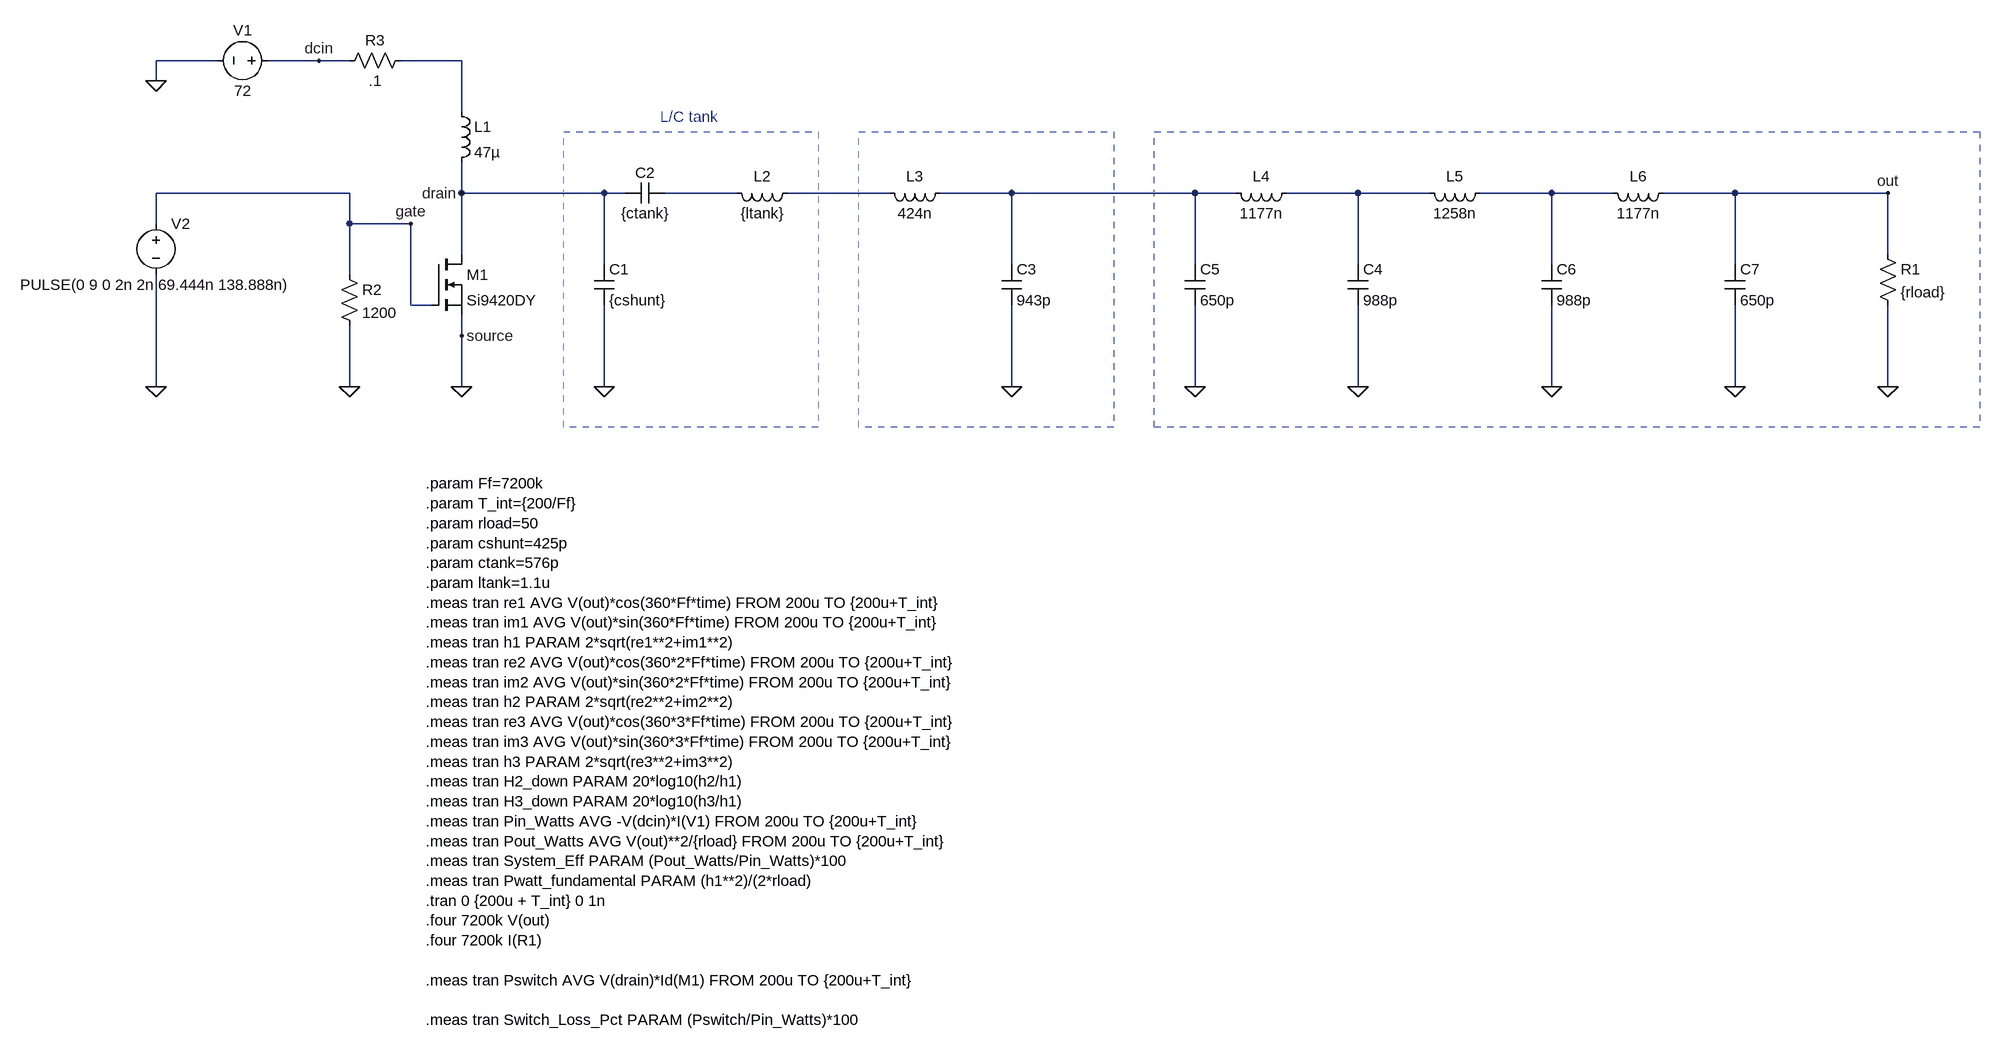
[diagram p0: schematic 7200KHZ_e.asc]
7200KHZ_e.asc, the LTspice schematic file:
Version 4.1
SHEET 1 2816 1392
WIRE -192 -272 -288 -272
WIRE -32 -272 -112 -272
WIRE 16 -272 -32 -272
WIRE 192 -272 96 -272
WIRE -288 -240 -288 -272
WIRE 192 -192 192 -272
WIRE 16 -64 -288 -64
WIRE 192 -64 192 -112
WIRE 416 -64 192 -64
WIRE 448 -64 416 -64
WIRE 624 -64 512 -64
WIRE 864 -64 704 -64
WIRE 1056 -64 944 -64
WIRE 1344 -64 1056 -64
WIRE 1408 -64 1344 -64
WIRE 1600 -64 1488 -64
WIRE 1712 -64 1600 -64
WIRE 1904 -64 1792 -64
WIRE 2000 -64 1904 -64
WIRE 2192 -64 2080 -64
WIRE 2432 -64 2192 -64
WIRE -288 -16 -288 -64
WIRE 16 -16 16 -64
WIRE 112 -16 16 -16
WIRE 192 32 192 -64
WIRE 2432 32 2432 -64
WIRE 416 48 416 -64
WIRE 1056 48 1056 -64
WIRE 1344 48 1344 -64
WIRE 1600 48 1600 -64
WIRE 1904 48 1904 -64
WIRE 2192 48 2192 -64
WIRE 16 64 16 -16
WIRE 112 112 112 -16
WIRE 144 112 112 112
WIRE 192 160 192 128
WIRE -288 240 -288 64
WIRE 16 240 16 144
WIRE 192 240 192 160
WIRE 416 240 416 112
WIRE 1056 240 1056 112
WIRE 1344 240 1344 112
WIRE 1600 240 1600 112
WIRE 1904 240 1904 112
WIRE 2192 240 2192 112
WIRE 2432 240 2432 112
FLAG 192 240 0
FLAG -288 -240 0
FLAG -288 240 0
FLAG 416 240 0
FLAG -32 -272 dcin
FLAG 16 240 0
FLAG 112 -16 gate
FLAG 192 -64 drain
FLAG 192 160 source
FLAG 1056 240 0
FLAG 1600 240 0
FLAG 1344 240 0
FLAG 1904 240 0
FLAG 2192 240 0
FLAG 2432 -64 out
FLAG 2432 240 0
SYMBOL nmos 144 32 R0
SYMATTR InstName M1
SYMATTR Value Si9420DY
SYMBOL ind 176 -208 R0
SYMATTR InstName L1
SYMATTR Value 47µ
SYMBOL cap 512 -80 R90
WINDOW 0 0 32 VBottom 2
WINDOW 3 32 32 VTop 2
SYMATTR InstName C2
SYMATTR Value {ctank}
SYMATTR SpiceLine Rser=0.1
SYMBOL ind 720 -80 R90
WINDOW 0 5 56 VBottom 2
WINDOW 3 32 56 VTop 2
SYMATTR InstName L2
SYMATTR Value {ltank}
SYMBOL voltage -288 -32 R0
WINDOW 123 0 0 Left 0
WINDOW 39 0 0 Left 0
WINDOW 3 -213 112 Left 2
SYMATTR Value PULSE(0 9 0 2n 2n 69.444n 138.888n)
SYMATTR InstName V2
SYMBOL res 0 48 R0
SYMATTR InstName R2
SYMATTR Value 1200
SYMBOL cap 400 48 R0
SYMATTR InstName C1
SYMATTR Value {cshunt}
SYMATTR SpiceLine Rser=0.1
SYMBOL res 112 -288 R90
WINDOW 0 0 56 VBottom 2
WINDOW 3 32 56 VTop 2
SYMATTR InstName R3
SYMATTR Value .1
SYMBOL voltage -96 -272 R90
WINDOW 0 -32 56 VBottom 2
WINDOW 3 32 56 VTop 2
WINDOW 123 0 0 Left 0
WINDOW 39 0 0 Left 0
SYMATTR InstName V1
SYMATTR Value 72
SYMBOL ind 960 -80 R90
WINDOW 0 5 56 VBottom 2
WINDOW 3 32 56 VTop 2
SYMATTR InstName L3
SYMATTR Value 424n
SYMBOL cap 1040 48 R0
SYMATTR InstName C3
SYMATTR Value 943p
SYMATTR SpiceLine Rser=0.1
SYMBOL ind 1504 -80 R90
WINDOW 0 5 56 VBottom 2
WINDOW 3 32 56 VTop 2
SYMATTR InstName L4
SYMATTR Value 1177n
SYMBOL cap 1584 48 R0
SYMATTR InstName C4
SYMATTR Value 988p
SYMATTR SpiceLine Rser=0.1
SYMBOL cap 1328 48 R0
SYMATTR InstName C5
SYMATTR Value 650p
SYMATTR SpiceLine Rser=0.1
SYMBOL ind 1808 -80 R90
WINDOW 0 5 56 VBottom 2
WINDOW 3 32 56 VTop 2
SYMATTR InstName L5
SYMATTR Value 1258n
SYMBOL cap 1888 48 R0
SYMATTR InstName C6
SYMATTR Value 988p
SYMATTR SpiceLine Rser=0.1
SYMBOL ind 2096 -80 R90
WINDOW 0 5 56 VBottom 2
WINDOW 3 32 56 VTop 2
SYMATTR InstName L6
SYMATTR Value 1177n
SYMBOL cap 2176 48 R0
SYMATTR InstName C7
SYMATTR Value 650p
SYMATTR SpiceLine Rser=0.1
SYMBOL res 2416 16 R0
SYMATTR InstName R1
SYMATTR Value {rload}
TEXT 136 392 Left 2 !.param Ff=7200k\n.param T_int={200/Ff}\n.param rload=50\n.param cshunt=425p\n.param ctank=576p\n.param ltank=1.1u\n.meas tran re1 AVG V(out)*cos(360*Ff*time) FROM 200u TO {200u+T_int}\n.meas tran im1 AVG V(out)*sin(360*Ff*time) FROM 200u TO {200u+T_int}\n.meas tran h1 PARAM 2*sqrt(re1**2+im1**2)\n.meas tran re2 AVG V(out)*cos(360*2*Ff*time) FROM 200u TO {200u+T_int}\n.meas tran im2 AVG V(out)*sin(360*2*Ff*time) FROM 200u TO {200u+T_int}\n.meas tran h2 PARAM 2*sqrt(re2**2+im2**2)\n.meas tran re3 AVG V(out)*cos(360*3*Ff*time) FROM 200u TO {200u+T_int}\n.meas tran im3 AVG V(out)*sin(360*3*Ff*time) FROM 200u TO {200u+T_int}\n.meas tran h3 PARAM 2*sqrt(re3**2+im3**2)\n.meas tran H2_down PARAM 20*log10(h2/h1)\n.meas tran H3_down PARAM 20*log10(h3/h1)\n.meas tran Pin_Watts AVG -V(dcin)*I(V1) FROM 200u TO {200u+T_int}\n.meas tran Pout_Watts AVG V(out)**2/{rload} FROM 200u TO {200u+T_int}\n.meas tran System_Eff PARAM (Pout_Watts/Pin_Watts)*100\n.meas tran Pwatt_fundamental PARAM (h1**2)/(2*rload)\n.tran 0 {200u + T_int} 0 1n\n.four 7200k V(out)\n.four 7200k I(R1)\n \n.meas tran Pswitch AVG V(drain)*Id(M1) FROM 200u TO {200u+T_int}\n \n.meas tran Switch_Loss_Pct PARAM (Pswitch/Pin_Watts)*100
TEXT 504 -184 Left 2 ;L/C tank
RECTANGLE Normal 752 304 352 -160 3
RECTANGLE Normal 1216 304 816 -160 3
RECTANGLE Normal 2576 304 1280 -160 3

The netlist it stands for:
* 7200KHZ_e.asc
M1 drain gate 0 0 Si9420DY
L1 N001 drain 47µ
C2 N002 drain {ctank} Rser=0.1
L2 N003 N002 {ltank}
V2 gate 0 PULSE(0 9 0 2n 2n 69.444n 138.888n)
R2 gate 0 1200
C1 drain 0 {cshunt} Rser=0.1
R3 N001 dcin .1
V1 dcin 0 72
L3 N004 N003 424n
C3 N004 0 943p Rser=0.1
L4 N005 N004 1177n
C4 N005 0 988p Rser=0.1
C5 N004 0 650p Rser=0.1
L5 N006 N005 1258n
C6 N006 0 988p Rser=0.1
L6 out N006 1177n
C7 out 0 650p Rser=0.1
R1 out 0 {rload}
.model NMOS NMOS
.model PMOS PMOS
.lib standard.mos
.param Ff=7200k
.param T_int={200/Ff}
.param rload=50
.param cshunt=425p
.param ctank=576p
.param ltank=1.1u
.meas tran re1 AVG V(out)*cos(360*Ff*time) FROM 200u TO {200u+T_int}
.meas tran im1 AVG V(out)*sin(360*Ff*time) FROM 200u TO {200u+T_int}
.meas tran h1 PARAM 2*sqrt(re1**2+im1**2)
.meas tran re2 AVG V(out)*cos(360*2*Ff*time) FROM 200u TO {200u+T_int}
.meas tran im2 AVG V(out)*sin(360*2*Ff*time) FROM 200u TO {200u+T_int}
.meas tran h2 PARAM 2*sqrt(re2**2+im2**2)
.meas tran re3 AVG V(out)*cos(360*3*Ff*time) FROM 200u TO {200u+T_int}
.meas tran im3 AVG V(out)*sin(360*3*Ff*time) FROM 200u TO {200u+T_int}
.meas tran h3 PARAM 2*sqrt(re3**2+im3**2)
.meas tran H2_down PARAM 20*log10(h2/h1)
.meas tran H3_down PARAM 20*log10(h3/h1)
.meas tran Pin_Watts AVG -V(dcin)*I(V1) FROM 200u TO {200u+T_int}
.meas tran Pout_Watts AVG V(out)**2/{rload} FROM 200u TO {200u+T_int}
.meas tran System_Eff PARAM (Pout_Watts/Pin_Watts)*100
.meas tran Pwatt_fundamental PARAM (h1**2)/(2*rload)
.tran 0 {200u + T_int} 0 1n
.four 7200k V(out)
.four 7200k I(R1)
.meas tran Pswitch AVG V(drain)*Id(M1) FROM 200u TO {200u+T_int}
.meas tran Switch_Loss_Pct PARAM (Pswitch/Pin_Watts)*100
* L/C tank
.backanno
.end